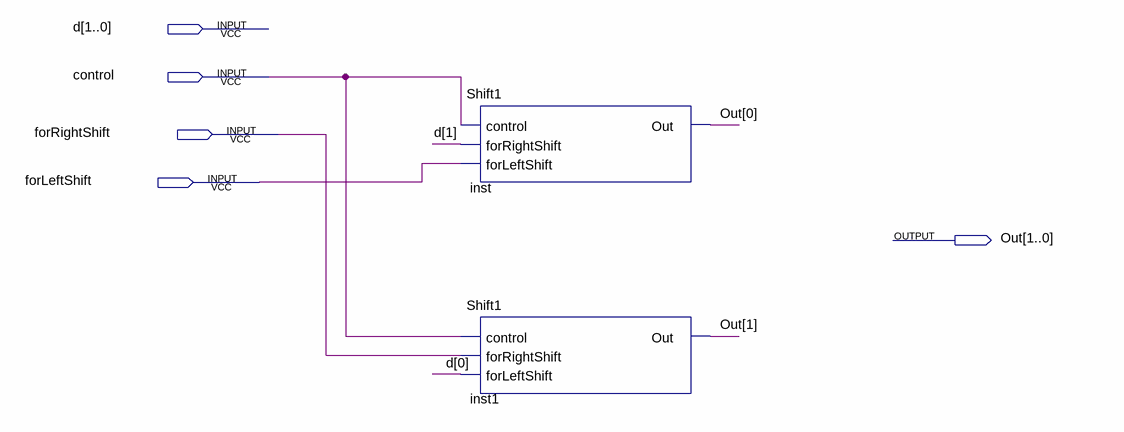
[diagram p0: schematic sheet]
// Quartus schematic Shift2.bdf as structural Verilog: 2 symbols, 5 pins
module Shift2 (
  input  [1:0] d,
  input  control,
  input  forRightShift,
  input  forLeftShift,
  output [1:0] Out
);

  Shift1 inst (.control(control), .forRightShift(d[1]), .forLeftShift(forLeftShift), .Out(Out[0]));
  Shift1 inst1 (.control(control), .forRightShift(forRightShift), .forLeftShift(d[0]), .Out(Out[1]));
endmodule
